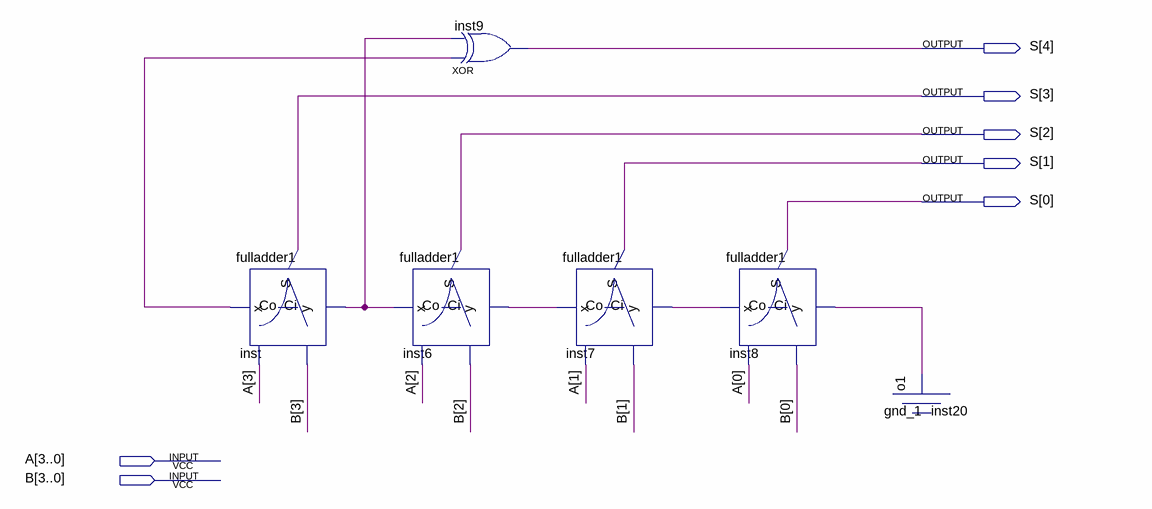
[diagram p0: schematic sheet]
// Quartus schematic fulladder4.bdf as structural Verilog: 6 symbols, 7 pins
module fulladder4 (
  input  [3:0] A,
  input  [3:0] B,
  output [4:0] S
);

  wire inst6_co, inst7_co, inst8_co, inst20_o1, inst_co;

  fulladder1 inst (.x(A[3]), .y(B[3]), .Ci(inst6_co), .S(S[3]), .Co(inst_co));
  xor inst9 (S[4], inst_co, inst6_co);
  fulladder1 inst6 (.x(A[2]), .y(B[2]), .Ci(inst7_co), .S(S[2]), .Co(inst6_co));
  fulladder1 inst7 (.x(A[1]), .y(B[1]), .Ci(inst8_co), .S(S[1]), .Co(inst7_co));
  fulladder1 inst8 (.x(A[0]), .y(B[0]), .Ci(inst20_o1), .S(S[0]), .Co(inst8_co));
  gnd_1 inst20 (.o1(inst20_o1));
endmodule
